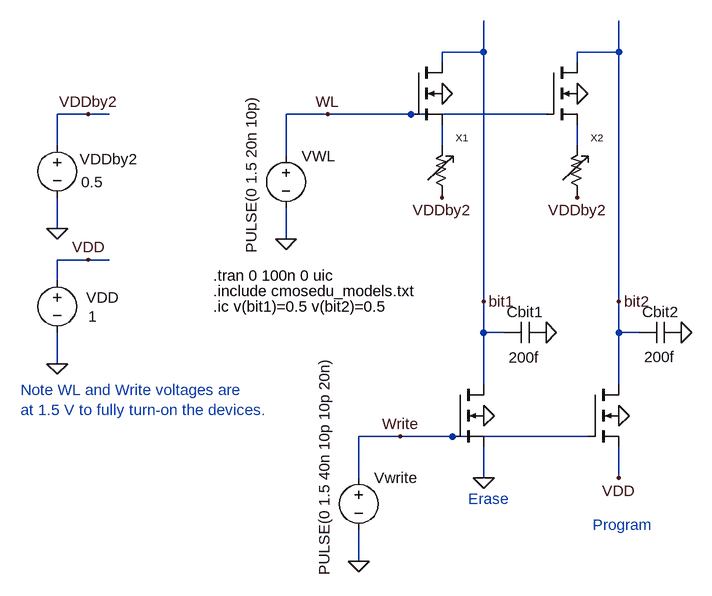
[diagram p0: schematic mbit_test2.asc]
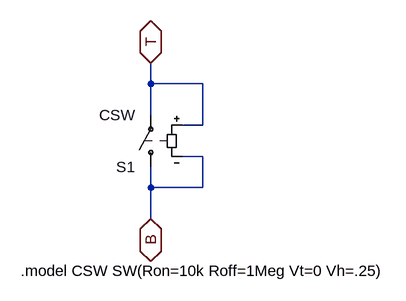
[diagram p1: sub-circuit mbit.asc]
mbit_test2.asc, the LTspice schematic file:
Version 4
SHEET 1 1464 792
WIRE 368 -16 368 -64
WIRE 368 -16 304 -16
WIRE 576 -16 576 -64
WIRE 576 -16 512 -16
WIRE 304 0 304 -16
WIRE 512 0 512 -16
WIRE -240 80 -288 80
WIRE -208 80 -240 80
WIRE 128 80 64 80
WIRE 256 80 128 80
WIRE 464 80 256 80
WIRE -288 128 -288 80
WIRE 304 128 304 96
WIRE 512 128 512 96
WIRE 64 144 64 80
WIRE -288 256 -288 208
WIRE 64 272 64 224
WIRE -240 304 -288 304
WIRE -208 304 -240 304
WIRE -288 336 -288 304
WIRE 368 368 368 -16
WIRE 576 368 576 -16
WIRE 368 416 368 368
WIRE 400 416 368 416
WIRE 576 416 576 368
WIRE 608 416 576 416
WIRE -288 464 -288 416
WIRE 368 496 368 416
WIRE 576 496 576 416
WIRE 240 576 176 576
WIRE 320 576 240 576
WIRE 528 576 320 576
WIRE 176 640 176 576
WIRE 368 640 368 592
WIRE 576 640 576 592
WIRE 176 768 176 720
FLAG 304 48 0
FLAG 304 208 VDDby2
FLAG 512 48 0
FLAG 512 208 VDDby2
FLAG 64 272 0
FLAG 128 80 WL
FLAG 464 416 0
FLAG 672 416 0
FLAG 368 544 0
FLAG 576 544 0
FLAG 176 768 0
FLAG 240 576 Write
FLAG 368 640 0
FLAG -288 464 0
FLAG 368 368 bit1
FLAG 576 368 bit2
FLAG -288 256 0
FLAG -240 80 VDDby2
FLAG -240 304 VDD
FLAG 576 640 VDD
SYMBOL mbit 304 128 R0
SYMATTR InstName X1
SYMBOL nmos4 256 0 R0
WINDOW 0 56 32 Invisible 0
WINDOW 3 56 72 Invisible 0
SYMATTR InstName M1
SYMATTR Value N_50n
SYMATTR Value2 l=50n w=250n
SYMBOL mbit 512 128 R0
SYMATTR InstName X2
SYMBOL nmos4 464 0 R0
WINDOW 0 56 32 Invisible 0
WINDOW 3 56 72 Invisible 0
SYMATTR InstName M2
SYMATTR Value N_50n
SYMATTR Value2 l=50n w=250n
SYMBOL voltage 64 128 R0
WINDOW 3 -53 166 VLeft 0
WINDOW 123 0 0 Left 0
WINDOW 39 0 0 Left 0
SYMATTR Value PULSE(0 1.5 20n 10p)
SYMATTR InstName VWL
SYMBOL cap 672 400 R90
WINDOW 0 0 32 VBottom 0
WINDOW 3 38 33 VTop 0
SYMATTR InstName Cbit2
SYMATTR Value 200f
SYMBOL cap 464 400 R90
WINDOW 0 0 32 VBottom 0
WINDOW 3 39 34 VTop 0
SYMATTR InstName Cbit1
SYMATTR Value 200f
SYMBOL nmos4 320 496 R0
WINDOW 0 56 32 Invisible 0
WINDOW 3 56 72 Invisible 0
SYMATTR InstName M3
SYMATTR Value N_50n
SYMATTR Value2 l=50n w=250n
SYMBOL nmos4 528 496 R0
WINDOW 0 56 32 Invisible 0
WINDOW 3 56 72 Invisible 0
SYMATTR InstName M4
SYMATTR Value N_50n
SYMATTR Value2 l=50n w=250n
SYMBOL voltage 176 624 R0
WINDOW 3 -53 166 VLeft 0
WINDOW 123 0 0 Left 0
WINDOW 39 0 0 Left 0
SYMATTR Value PULSE(0 1.5 40n 10p 10p 20n)
SYMATTR InstName Vwrite
SYMBOL voltage -288 320 R0
WINDOW 0 45 42 Left 0
WINDOW 3 48 71 Left 0
SYMATTR InstName VDD
SYMATTR Value 1
SYMBOL voltage -288 112 R0
WINDOW 0 35 37 Left 0
WINDOW 3 37 72 Left 0
SYMATTR InstName VDDby2
SYMATTR Value 0.5
TEXT -48 352 Left 0 !.include cmosedu_models.txt
TEXT -48 328 Left 0 !.tran 0 100n 0 uic
TEXT -48 376 Left 0 !.ic v(bit1)=0.5 v(bit2)=0.5
TEXT -344 504 Left 0 ;Note WL and Write voltages are \nat 1.5 V to fully turn-on the devices.
TEXT 344 672 Left 0 ;Erase
TEXT 536 712 Left 0 ;Program

mbit.asc, the sub-circuit schematic file:
Version 4
SHEET 1 984 680
WIRE -288 -128 -288 -160
WIRE -208 -128 -288 -128
WIRE -288 -80 -288 -128
WIRE -208 -64 -208 -128
WIRE -208 -64 -240 -64
WIRE -208 -16 -240 -16
WIRE -288 32 -288 0
WIRE -208 32 -208 -16
WIRE -208 32 -288 32
WIRE -288 80 -288 32
FLAG -288 -160 T
IOPIN -288 -160 BiDir
FLAG -288 80 B
IOPIN -288 80 BiDir
SYMBOL sw -288 16 R180
SYMATTR InstName S1
SYMATTR Value CSW
TEXT -488 160 Left 0 !.model CSW SW(Ron=10k Roff=1Meg Vt=0 Vh=.25)

The netlist it stands for:
* mbit_test2.asc
XX1 N001 VDDby2 mbit
M1 bit1 WL N001 0 N_50n l=50n w=250n
XX2 N002 VDDby2 mbit
M2 bit2 WL N002 0 N_50n l=50n w=250n
VWL WL 0 PULSE(0 1.5 20n 10p)
Cbit2 0 bit2 200f
Cbit1 0 bit1 200f
M3 bit1 Write 0 0 N_50n l=50n w=250n
M4 bit2 Write VDD 0 N_50n l=50n w=250n
Vwrite Write 0 PULSE(0 1.5 40n 10p 10p 20n)
VDD VDD 0 1
VDDby2 VDDby2 0 0.5

* block symbol definitions
.subckt mbit T B
S1 B T T B CSW
.model CSW SW(Ron=10k Roff=1Meg Vt=0 Vh=.25)
.ends mbit

.model NMOS NMOS
.model PMOS PMOS
.lib standard.mos
.include cmosedu_models.txt
.tran 0 100n 0 uic
.ic v(bit1)=0.5 v(bit2)=0.5
* Note WL and Write voltages are
* at 1.5 V to fully turn-on the devices.
* Erase
* Program
.backanno
.end